# EAGLE schematic bq2550_shield (EAGLE 7.2.0)
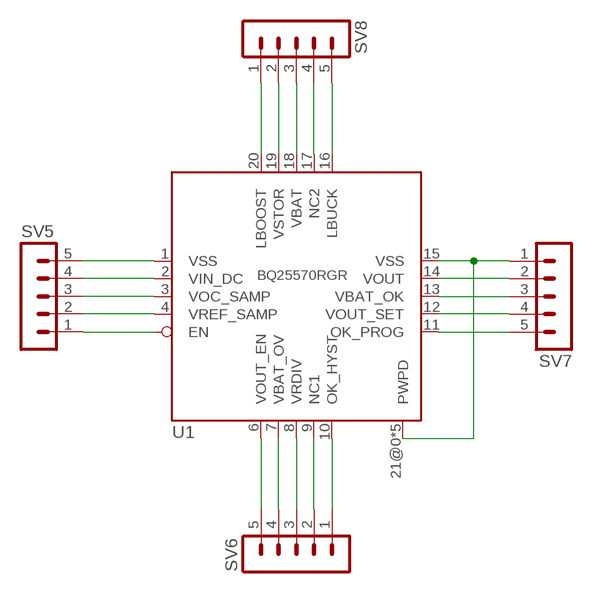
[diagram p0: schematic, sheet 1]

## Parts
SV5  MA05-1  [MA05-1]
SV6  MA05-1  [MA05-1]
SV7  MA05-1  [MA05-1]
SV8  MA05-1  [MA05-1]
U1  BQ25570RGR  [QFN20]

## Nets
N$1: SV5.5 U1.1(VSS)
N$2: SV5.4 U1.2(VIN_DC)
N$3: SV5.3 U1.3(VOC_SAMP)
N$4: SV5.2 U1.4(VREF_SAMP)
N$5: SV5.1 U1.5(EN)
N$6: SV6.5 U1.6(VOUT_EN)
N$7: SV6.4 U1.7(VBAT_OV)
N$8: SV6.3 U1.8(VRDIV)
N$9: SV6.2 U1.9(NC1)
N$10: SV6.1 U1.10(OK_HYST)
N$11: SV7.5 U1.11(OK_PROG)
N$12: SV7.4 U1.12(VOUT_SET)
N$13: SV7.3 U1.13(VBAT_OK)
N$14: SV7.2 U1.14(VOUT)
N$15: SV7.1 U1.15(VSS) U1.21@0(PWPD) U1.21@1(PWPD) U1.21@2(PWPD) U1.21@3(PWPD) U1.21@4(PWPD)
N$16: SV8.1 U1.20(LBOOST)
N$17: SV8.2 U1.19(VSTOR)
N$18: SV8.3 U1.18(VBAT)
N$19: SV8.4 U1.17(NC2)
N$20: SV8.5 U1.16(LBUCK)

## Library data of the parts
SV5-SV8 = con-lstb:MA05-1: PIN HEADER; OC_FARNELL: unknown; OC_NEWARK: unknown
U1 = 2642.TI_BQ25570:BQ25570: TEXAS INSTRUMENTS BQ25570 - VQFN20 http://www.ti.com/lit/ds/symlink/bq25570.pdf